# EAGLE design bc-cpu (EAGLE 7.3.0)
CNAME: Battery Bank Display Controller; CREVISION: 1.0; DESIGNER: Andrew Maltsev
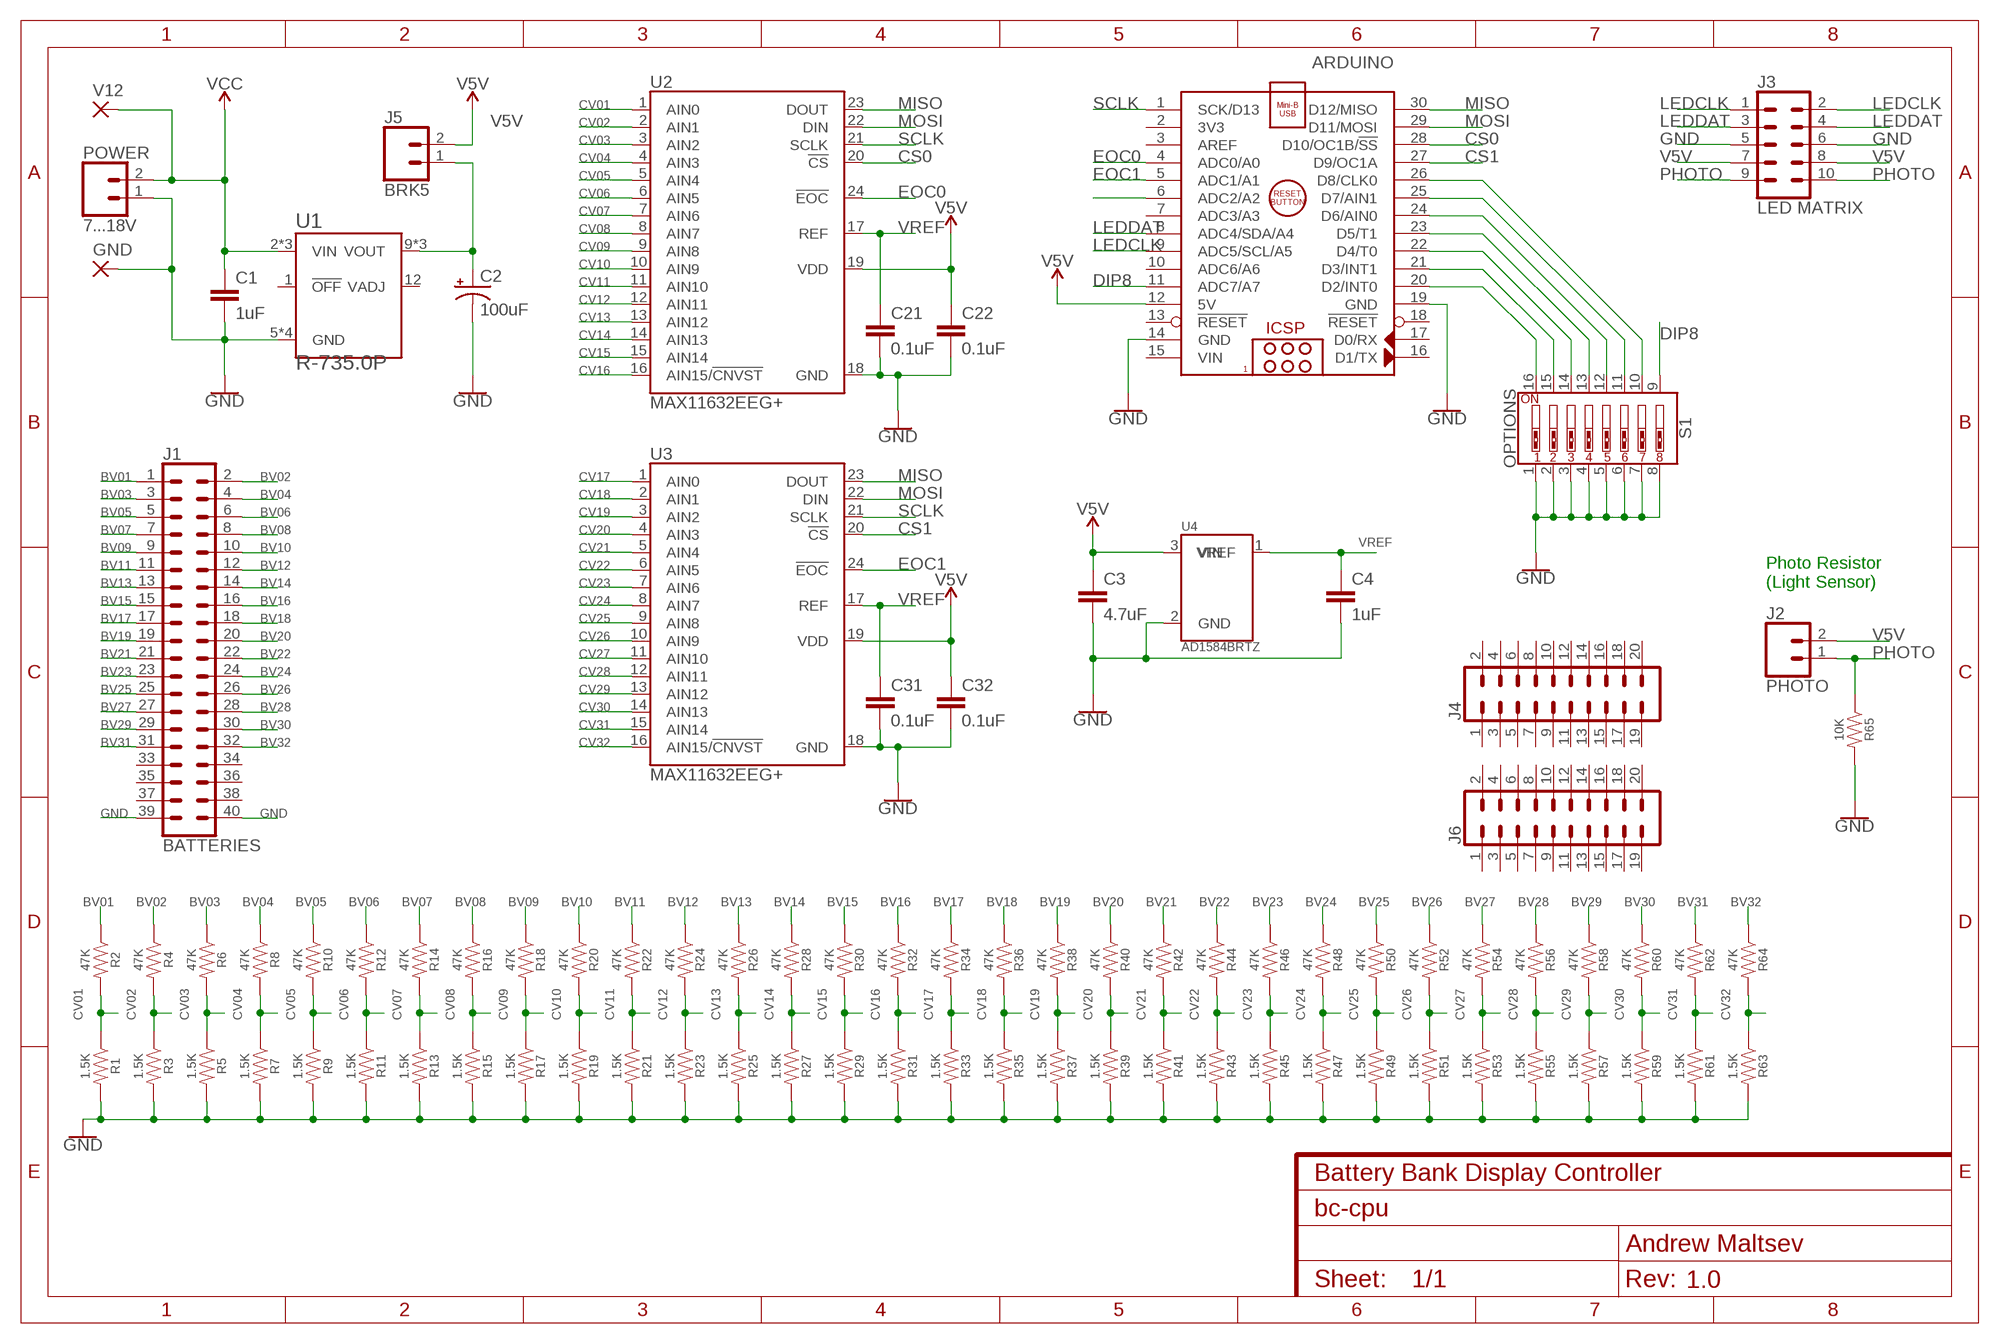
[diagram p0: schematic, sheet 1]

## Parts
ARDUINO  ARDUINO_NANO  [ARDUINO_NANO]
C1  1uF  C5/3  [C5B3]
C2  100uF  100UF-POLAR-RADIAL-2.5MM-25V-20%  [CPOL-RADIAL-2.5MM-6.5MM]
C3  4.7uF  C5/3  [C5B3]
C4  1uF  C5/3  [C5B3]
C21  0.1uF  C5/3  [C5B3]
C22  0.1uF  C5/3  [C5B3]
C31  0.1uF  C5/3  [C5B3]
C32  0.1uF  C5/3  [C5B3]
GND  WIREPAD3,17/1,2  [3,17/1,2]
J1  BATTERIES  CONN_20X2SHROUDED  [2X20_SHROUDED]
J2  PHOTO  CONN_02  [1X02]
J3  LED MATRIX  CONN_05X2SHD  [2X5-SHROUDED]
J4  CONN_10X2NOSILK  [2X10_NOSILK]
J5  BRK5  CONN_02  [1X02]
J6  CONN_10X2NOSILK  [2X10_NOSILK]
POWER  7...18V  CONN_02  [1X02]
R1  1.5K  RESISTOR1206  [1206]
R2  47K  RESISTOR1206  [1206]
R3  1.5K  RESISTOR1206  [1206]
R4  47K  RESISTOR1206  [1206]
R5  1.5K  RESISTOR1206  [1206]
R6  47K  RESISTOR1206  [1206]
R7  1.5K  RESISTOR1206  [1206]
R8  47K  RESISTOR1206  [1206]
R9  1.5K  RESISTOR1206  [1206]
R10  47K  RESISTOR1206  [1206]
R11  1.5K  RESISTOR1206  [1206]
R12  47K  RESISTOR1206  [1206]
R13  1.5K  RESISTOR1206  [1206]
R14  47K  RESISTOR1206  [1206]
R15  1.5K  RESISTOR1206  [1206]
R16  47K  RESISTOR1206  [1206]
R17  1.5K  RESISTOR1206  [1206]
R18  47K  RESISTOR1206  [1206]
R19  1.5K  RESISTOR1206  [1206]
R20  47K  RESISTOR1206  [1206]
R21  1.5K  RESISTOR1206  [1206]
R22  47K  RESISTOR1206  [1206]
R23  1.5K  RESISTOR1206  [1206]
R24  47K  RESISTOR1206  [1206]
R25  1.5K  RESISTOR1206  [1206]
R26  47K  RESISTOR1206  [1206]
R27  1.5K  RESISTOR1206  [1206]
R28  47K  RESISTOR1206  [1206]
R29  1.5K  RESISTOR1206  [1206]
R30  47K  RESISTOR1206  [1206]
R31  1.5K  RESISTOR1206  [1206]
R32  47K  RESISTOR1206  [1206]
R33  1.5K  RESISTOR1206  [1206]
R34  47K  RESISTOR1206  [1206]
R35  1.5K  RESISTOR1206  [1206]
R36  47K  RESISTOR1206  [1206]
R37  1.5K  RESISTOR1206  [1206]
R38  47K  RESISTOR1206  [1206]
R39  1.5K  RESISTOR1206  [1206]
R40  47K  RESISTOR1206  [1206]
R41  1.5K  RESISTOR1206  [1206]
R42  47K  RESISTOR1206  [1206]
R43  1.5K  RESISTOR1206  [1206]
R44  47K  RESISTOR1206  [1206]
R45  1.5K  RESISTOR1206  [1206]
R46  47K  RESISTOR1206  [1206]
R47  1.5K  RESISTOR1206  [1206]
R48  47K  RESISTOR1206  [1206]
R49  1.5K  RESISTOR1206  [1206]
R50  47K  RESISTOR1206  [1206]
R51  1.5K  RESISTOR1206  [1206]
R52  47K  RESISTOR1206  [1206]
R53  1.5K  RESISTOR1206  [1206]
R54  47K  RESISTOR1206  [1206]
R55  1.5K  RESISTOR1206  [1206]
R56  47K  RESISTOR1206  [1206]
R57  1.5K  RESISTOR1206  [1206]
R58  47K  RESISTOR1206  [1206]
R59  1.5K  RESISTOR1206  [1206]
R60  47K  RESISTOR1206  [1206]
R61  1.5K  RESISTOR1206  [1206]
R62  47K  RESISTOR1206  [1206]
R63  1.5K  RESISTOR1206  [1206]
R64  47K  RESISTOR1206  [1206]
R65  10K  RESISTORAXIAL-0.3  [AXIAL-0.3]
S1  OPTIONS  DIP-08-PTH  [DIPSWITCH-08]
U1  R-735.0P  RECOM-R-7XX.XXPTH  [RECOM-R-7XX.XX]
U2  MAX11632EEG+  MAX-11632QSOP24  [QSOP24]
U3  MAX11632EEG+  MAX-11632QSOP24  [QSOP24]
U4  AD1584BRTZ  AD1582  [SOT23-3]
V12  WIREPAD3,17/1,2  [3,17/1,2]

## Nets
BV01: J1.1 R2.1
BV02: J1.2 R4.1
BV03: J1.3 R6.1
BV04: J1.4 R8.1
BV05: J1.5 R10.1
BV06: J1.6 R12.1
BV07: J1.7 R14.1
BV08: J1.8 R16.1
BV09: J1.9 R18.1
BV10: J1.10 R20.1
BV11: J1.11 R22.1
BV12: J1.12 R24.1
BV13: J1.13 R26.1
BV14: J1.14 R28.1
BV15: J1.15 R30.1
BV16: J1.16 R32.1
BV17: J1.17 R34.1
BV18: J1.18 R36.1
BV19: J1.19 R38.1
BV20: J1.20 R40.1
BV21: J1.21 R42.1
BV22: J1.22 R44.1
BV23: J1.23 R46.1
BV24: J1.24 R48.1
BV25: J1.25 R50.1
BV26: J1.26 R52.1
BV27: J1.27 R54.1
BV28: J1.28 R56.1
BV29: J1.29 R58.1
BV30: J1.30 R60.1
BV31: J1.31 R62.1
BV32: J1.32 R64.1
CS0: ARDUINO.28(D10/OC1B/!SS) U2.20(!CS)
CS1: ARDUINO.27(D9/OC1A) U3.20(!CS)
CV01: R1.1 R2.2 U2.1(AIN0)
CV02: R3.1 R4.2 U2.2(AIN1)
CV03: R5.1 R6.2 U2.3(AIN2)
CV04: R7.1 R8.2 U2.4(AIN3)
CV05: R9.1 R10.2 U2.5(AIN4)
CV06: R11.1 R12.2 U2.6(AIN5)
CV07: R13.1 R14.2 U2.7(AIN6)
CV08: R15.1 R16.2 U2.8(AIN7)
CV09: R17.1 R18.2 U2.9(AIN8)
CV10: R19.1 R20.2 U2.10(AIN9)
CV11: R21.1 R22.2 U2.11(AIN10)
CV12: R23.1 R24.2 U2.12(AIN11)
CV13: R25.1 R26.2 U2.13(AIN12)
CV14: R27.1 R28.2 U2.14(AIN13)
CV15: R29.1 R30.2 U2.15(AIN14)
CV16: R31.1 R32.2 U2.16(AIN15/!CNVST)
CV17: R33.1 R34.2 U3.1(AIN0)
CV18: R35.1 R36.2 U3.2(AIN1)
CV19: R37.1 R38.2 U3.3(AIN2)
CV20: R39.1 R40.2 U3.4(AIN3)
CV21: R41.1 R42.2 U3.5(AIN4)
CV22: R43.1 R44.2 U3.6(AIN5)
CV23: R45.1 R46.2 U3.7(AIN6)
CV24: R47.1 R48.2 U3.8(AIN7)
CV25: R49.1 R50.2 U3.9(AIN8)
CV26: R51.1 R52.2 U3.10(AIN9)
CV27: R53.1 R54.2 U3.11(AIN10)
CV28: R55.1 R56.2 U3.12(AIN11)
CV29: R57.1 R58.2 U3.13(AIN12)
CV30: R59.1 R60.2 U3.14(AIN13)
CV31: R61.1 R62.2 U3.15(AIN14)
CV32: R63.1 R64.2 U3.16(AIN15/!CNVST)
DIP1: ARDUINO.20(D2/INT0) S1.16
DIP2: ARDUINO.21(D3/INT1) S1.15
DIP3: ARDUINO.22(D4/T0) S1.14
DIP4: ARDUINO.23(D5/T1) S1.13
DIP5: ARDUINO.24(D6/AIN0) S1.12
DIP6: ARDUINO.25(D7/AIN1) S1.11
DIP7: ARDUINO.26(D8/CLK0) S1.10
DIP8: ARDUINO.11(ADC7/A7) S1.9
EOC0: ARDUINO.4(ADC0/A0) U2.24(!EOC)
EOC1: ARDUINO.5(ADC1/A1) U3.24(!EOC)
GND: ARDUINO.14(GND) ARDUINO.19(GND) C1.2 C2.2(-) C3.2 C4.2 C21.2 C22.2 C31.2 C32.2 GND.1(P) J1.39 J1.40 J3.5 J3.6 POWER.1 R1.2 R3.2 R5.2 R7.2 R9.2 R11.2 R13.2 R15.2 R17.2 R19.2 R21.2 R23.2 R25.2 R27.2 R29.2 R31.2 R33.2 R35.2 R37.2 R39.2 R41.2 R43.2 R45.2 R47.2 R49.2 R51.2 R53.2 R55.2 R57.2 R59.2 R61.2 R63.2 R65.P$2 S1.1 S1.2 S1.3 S1.4 S1.5 S1.6 S1.7 S1.8 U1.5(GND) U1.6(GND) U1.7(GND) U1.8(GND) U2.18(GND) U3.18(GND) U4.2(GND)
LEDCLK: ARDUINO.9(ADC5/SCL/A5) J3.1 J3.2
LEDDAT: ARDUINO.8(ADC4/SDA/A4) J3.3 J3.4
MISO: ARDUINO.30(D12/MISO) U2.23(DOUT) U3.23(DOUT)
MOSI: ARDUINO.29(D11/MOSI) U2.22(DIN) U3.22(DIN)
N$11: C2.1(+) J5.1 U1.9(VOUT) U1.10(VOUT) U1.11(VOUT)
PHOTO: ARDUINO.6(ADC2/A2) J2.1 J3.9 J3.10 R65.P$1
SCLK: ARDUINO.1(SCK/D13) U2.21(SCLK) U3.21(SCLK)
V5V: ARDUINO.12(5V) C3.1 C22.1 C32.1 J2.2 J3.7 J3.8 J5.2 U2.19(VDD) U3.19(VDD) U4.3(VIN)
VCC: C1.1 POWER.2 U1.2(VIN) U1.3(VIN) U1.4(VIN) V12.1(P)
VREF: C4.1 C21.1 C31.1 U2.17(REF) U3.17(REF) U4.1(VREF)
Unconnected: ARDUINO.2(3V3) ARDUINO.3(AREF) ARDUINO.7(ADC3/A3) ARDUINO.10(ADC6/A6) ARDUINO.13(!RESET) ARDUINO.16(D1/TX) ARDUINO.17(D0/RX) ARDUINO.18(!RESET) J1.33 J1.34 J1.35 J1.36 J1.37 J1.38 J4.1 J4.2 J4.3 J4.4 J4.5 J4.6 J4.7 J4.8 J4.9 J4.10 J4.11 J4.12 J4.13 J4.14 J4.15 J4.16 J4.17 J4.18 J4.19 J4.20 J6.1 J6.2 J6.3 J6.4 J6.5 J6.6 J6.7 J6.8 J6.9 J6.10 J6.11 J6.12 J6.13 J6.14 J6.15 J6.16 J6.17 J6.18 J6.19 J6.20 U1.1(!OFF) U1.12(VADJ)

## Notes on the sheet
- Photo Resistor
  (Light Sensor)

## Power pins joined to a net without a drawn wire
VIN: ARDUINO.15(VIN)

## Library data of the parts
ARDUINO = ArduinoNanoV30:ARDUINO_NANO: Arduino Nano V3.0 Module Overview: The Arduino Nano is a small, complete, and breadboard-friendly board based on the ATmega328 (Arduino Nano 3.x) or ATmega168 (Arduino Nano 2.x). It has more or less the same functionality of the Arduino Duemilanove, but in a different package. It lacks only a DC power jack, and works with a Mini-B USB cable instead of a standard one. The Nano was designed and is being produced by Gravitech <http://www.gravitech.us/arna30wiatp.html>. General specifications: Item Value Microcontroller Atmel ATmega168 or ATmega328 Operating Voltage (logic level) 5 V Input Voltage (recommended) 7-12 V Input Voltage (limits) 6-20 V Digital I/O Pins 14 (of which 6 provide PWM output) Analog Input Pins 8 DC Current per I/O Pin 40 mA Flash Memory 16 KB (ATmega168) or 32 KB (ATmega328) of which 2 KB used by bootloader SRAM 1 KB (ATmega168) or 2 KB (ATmega328) EEPROM 512 bytes (ATmega168) or 1 KB (ATmega328) Clock Speed 16 MHz Dimensions (Inches) 0.73" x 1.70" Dimensions (mm) 18mm x 45mm Overall height About 9 mm (not including pins) Weigth 5 g Power: The Arduino Nano can be powered via the Mini-B USB connection, 6-20V unregulated external power supply (pin 30), or 5V regulated external power supply (pin 27). The power source is automatically selected to the highest voltage source. Memory: The ATmega168 has 16 KB of flash memory for storing code (of which 2 KB is used for the bootloader); the ATmega328 has 32 KB, (also with 2 KB used for the bootloader). The ATmega168 has 1 KB of SRAM and 512 bytes of EEPROM (which can be read and written with the EEPROM library); the ATmega328 has 2 KB of SRAM and 1 KB of EEPROM. Input and Output: Each of the 14 digital pins on the Nano can be used as an input or output, using pinMode(), digitalWrite(), and digitalRead() functions. They operate at 5 volts. Each pin can provide or receive a maximum of 40 mA and has an internal pull-up resistor (disconnected by default) of 20-50 kOhms. In addition, some pins have specialized functions. Visit Arduino - ArduinoBoardNano <https://www.arduino.cc/en/Main/ArduinoBoardNano>
C1 C3 C4 C21 C22 C31 C32 = capacitor-wima:C: CAPACITOR naming: grid - package width
C2 = SparkFun-Capacitors:100UF-POLAR: 100µF polarized capacitors A capacitor is a passive two-terminal electrical component used to store electrical energy temporarily in an electric field.; PROD_ID: CAP-08439
GND V12 = wirepad:WIREPAD: Wire PAD connect wire on PCB
J1 = SparkFun-Connectors:CONN_20X2: Multi connection point. Often used as Generic Header-pin footprint for 0.1 inch spaced/style header connections On any of the 0.1 inch spaced packages, you can populate with these: Break Away Headers - Straight <https://www.sparkfun.com/products/116> (PRT-00116) Break Away Male Headers - Right Angle <https://www.sparkfun.com/products/553> (PRT-00553) Female Headers <https://www.sparkfun.com/products/115> (PRT-00115) Break Away Headers - Machine Pin <https://www.sparkfun.com/products/117> (PRT-00117) Break Away Female Headers - Swiss Machine Pin <https://www.sparkfun.com/products/743> (PRT-00743); PROD_ID: CONN-12263; SF_ID: CONN-12263
J2 J5 POWER = SparkFun-Connectors:CONN_02: Multi connection point. Often used as Generic Header-pin footprint for 0.1 inch spaced/style header connections On any of the 0.1 inch spaced packages, you can populate with these: Break Away Headers - Straight <https://www.sparkfun.com/products/116> (PRT-00116) Break Away Male Headers - Right Angle <https://www.sparkfun.com/products/553> (PRT-00553) Female Headers <https://www.sparkfun.com/products/115> (PRT-00115) Break Away Headers - Machine Pin <https://www.sparkfun.com/products/117> (PRT-00117) Break Away Female Headers - Swiss Machine Pin <https://www.sparkfun.com/products/743> (PRT-00743) For SCREWTERMINALS and SPRING TERMINALS visit here: Screw Terimnals on SparkFun.com <https://www.sparkfun.com/search/results?term=Screw+Terminals> (5mm/3.5mm/2.54mm spacing) This device is also useful as a general connection point to wire up your design to another part of your project. Our various solder wires solder well into these plated through hole pads. Hook-Up Wire - Assortment (Stranded, 22 AWG) <https://www.sparkfun.com/products/11375> (PRT-11375) Hook-Up Wire - Assortment (Solid Core, 22 AWG) <https://www.sparkfun.com/products/11367> (PRT-11367) View the entire wire category on our website here <https://www.sparkfun.com/categories/141> Special notes: Molex polarized connector foot print use with: PRT-08233 with associated crimp pins and housings. 2.54_SCREWTERM for use with PRT-10571. 3.5mm Screw Terminal footprints for PRT-08084 5mm Screw Terminal footprints for use with PRT-08432
J3 = SparkFun-Connectors:CONN_05X2: Multi connection point. Often used as Generic Header-pin footprint for 0.1 inch spaced/style header connections For AVR SPI programming port, see special device with nice symbol: "AVR_SPI_PROG_5x2.dev" You can populate with any combo of single row headers, but if you'd like an exact match, check these: 2x5 AVR ICSP Male Header <https://www.sparkfun.com/products/778> (PRT-00778) 2x5 Pin Shrouded Header <https://www.sparkfun.com/products/8506> (PRT-08506) On any of the 0.1 inch spaced packages, you can populate with these: Break Away Headers - Straight <https://www.sparkfun.com/products/116> (PRT-00116) Break Away Male Headers - Right Angle <https://www.sparkfun.com/products/553> (PRT-00553) Female Headers <https://www.sparkfun.com/products/115> (PRT-00115) Break Away Headers - Machine Pin <https://www.sparkfun.com/products/117> (PRT-00117) Break Away Female Headers - Swiss Machine Pin <https://www.sparkfun.com/products/743> (PRT-00743) Special note: the shrouded connector mates well with our 5x2 ribbon cables: 2x5 Pin IDC Ribbon Cable <https://www.sparkfun.com/products/8535> (PRT-08535); PROD_ID: CONN-08671; SF_ID: PRT-08506
J4 J6 = SparkFun-Connectors:CONN_10X2: Multi connection point. Often used as Generic Header-pin footprint for 0.1 inch spaced/style header connections On any of the 0.1 inch spaced packages, you can populate with these: Break Away Headers - Straight <https://www.sparkfun.com/products/116> (PRT-00116) Break Away Male Headers - Right Angle <https://www.sparkfun.com/products/553> (PRT-00553) Female Headers <https://www.sparkfun.com/products/115> (PRT-00115) Break Away Headers - Machine Pin <https://www.sparkfun.com/products/117> (PRT-00117) Break Away Female Headers - Swiss Machine Pin <https://www.sparkfun.com/products/743> (PRT-00743) Special note about the "SPECIAL" package: This was SPECIALLY designed to be used with our Graphic LCD Backpack. Be sure you want to use this! It is not only staggered on each line of header holes, but IT IS ALSO offset of the center point of the top and bottom lines by 5 mil. This causes the headers to lock into place on the "standard" footprint on the LCD screen. The extra squares on the tdocu layer are there simply to reference other pins (if you were to actually populate a longer header than ten long - this is what we do with the backpacks).
R1-R65 = SparkFun-Resistors:RESISTOR: Generic Resistor Package
S1 = SparkFun-Switches:DIP-08: 8-Position DIP Switch 8-circuit DIP (dual inline package) switch. Commonly used to physcially set a circuit's behavior. SparkFun Products DIP Switch - 8 Position <https://www.sparkfun.com/products/8034> (COM-08034); PROD_ID: SWCH-12197; SF_SKU: COM-08034
U1 = Recom-R-735:RECOM-R-7XX.XX: RECOM R-7xx.xx DC-DC high efficiency board mounted voltage converter.
U2 U3 = MAX-11632:MAX-11632: MAX-11632 16-channel 12-Bit, 300ksps ADC with FIFO and Internal Reference https://www.digikey.com/product-detail/en/maxim-integrated/MAX11632EEG-/MAX11632EEG--ND/2591495
U4 = VREF-AD1582-85:AD1582

## Board
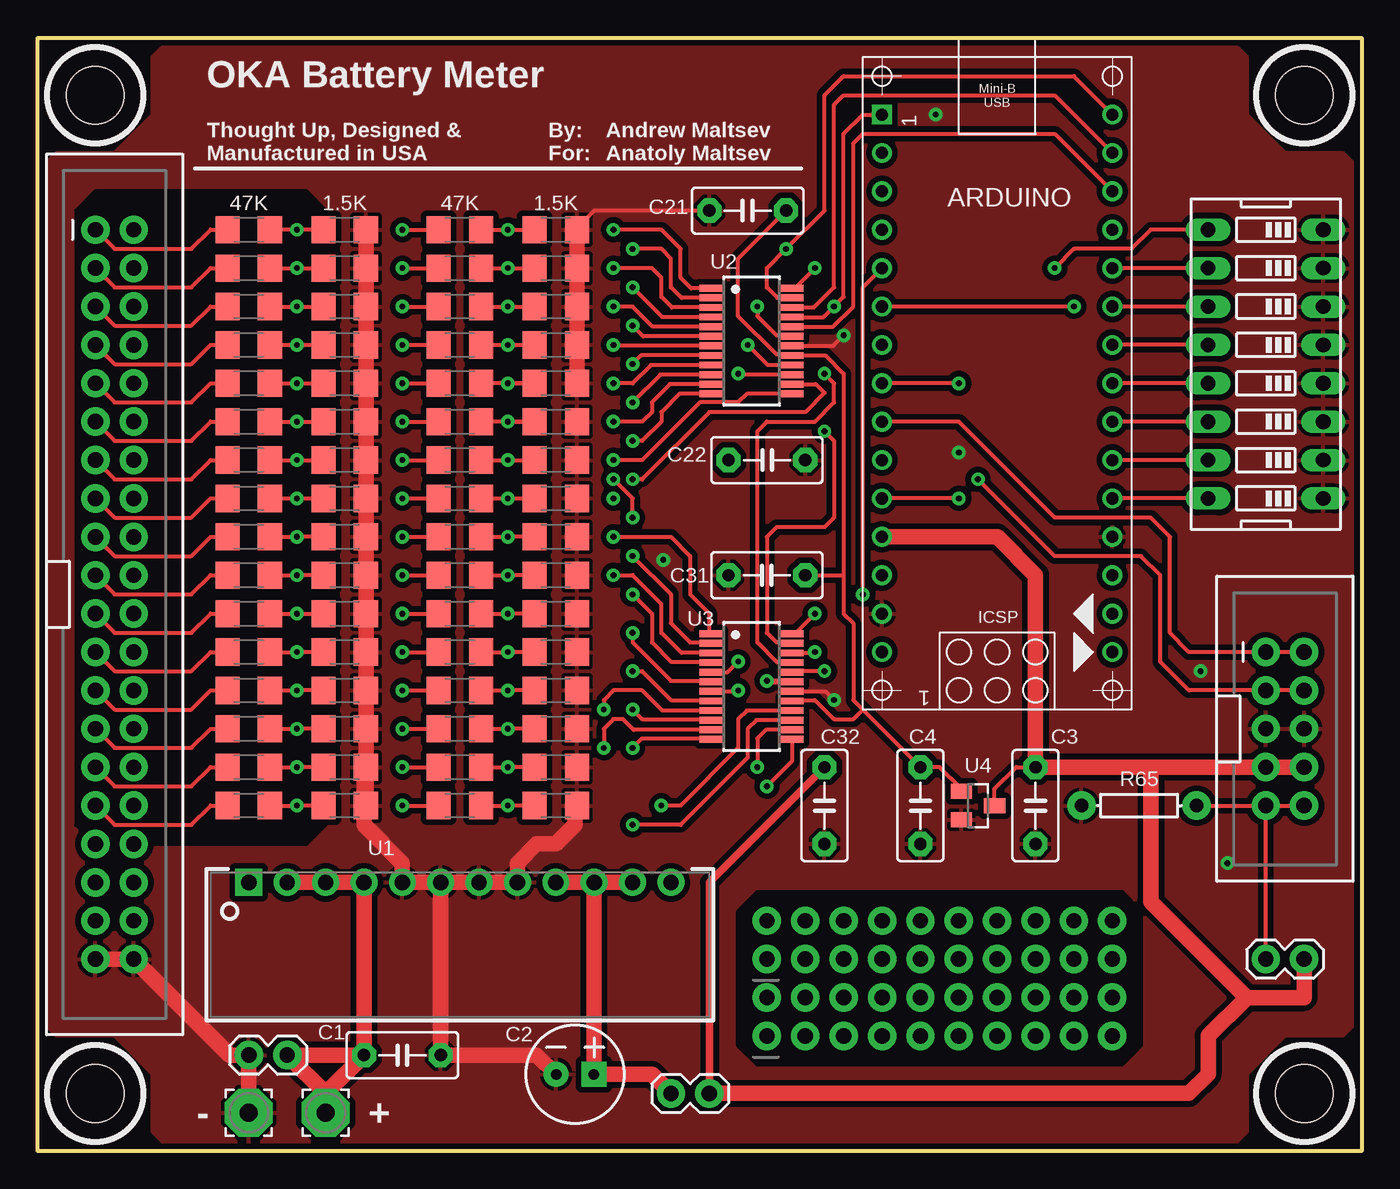
[diagram p1: board, top side]
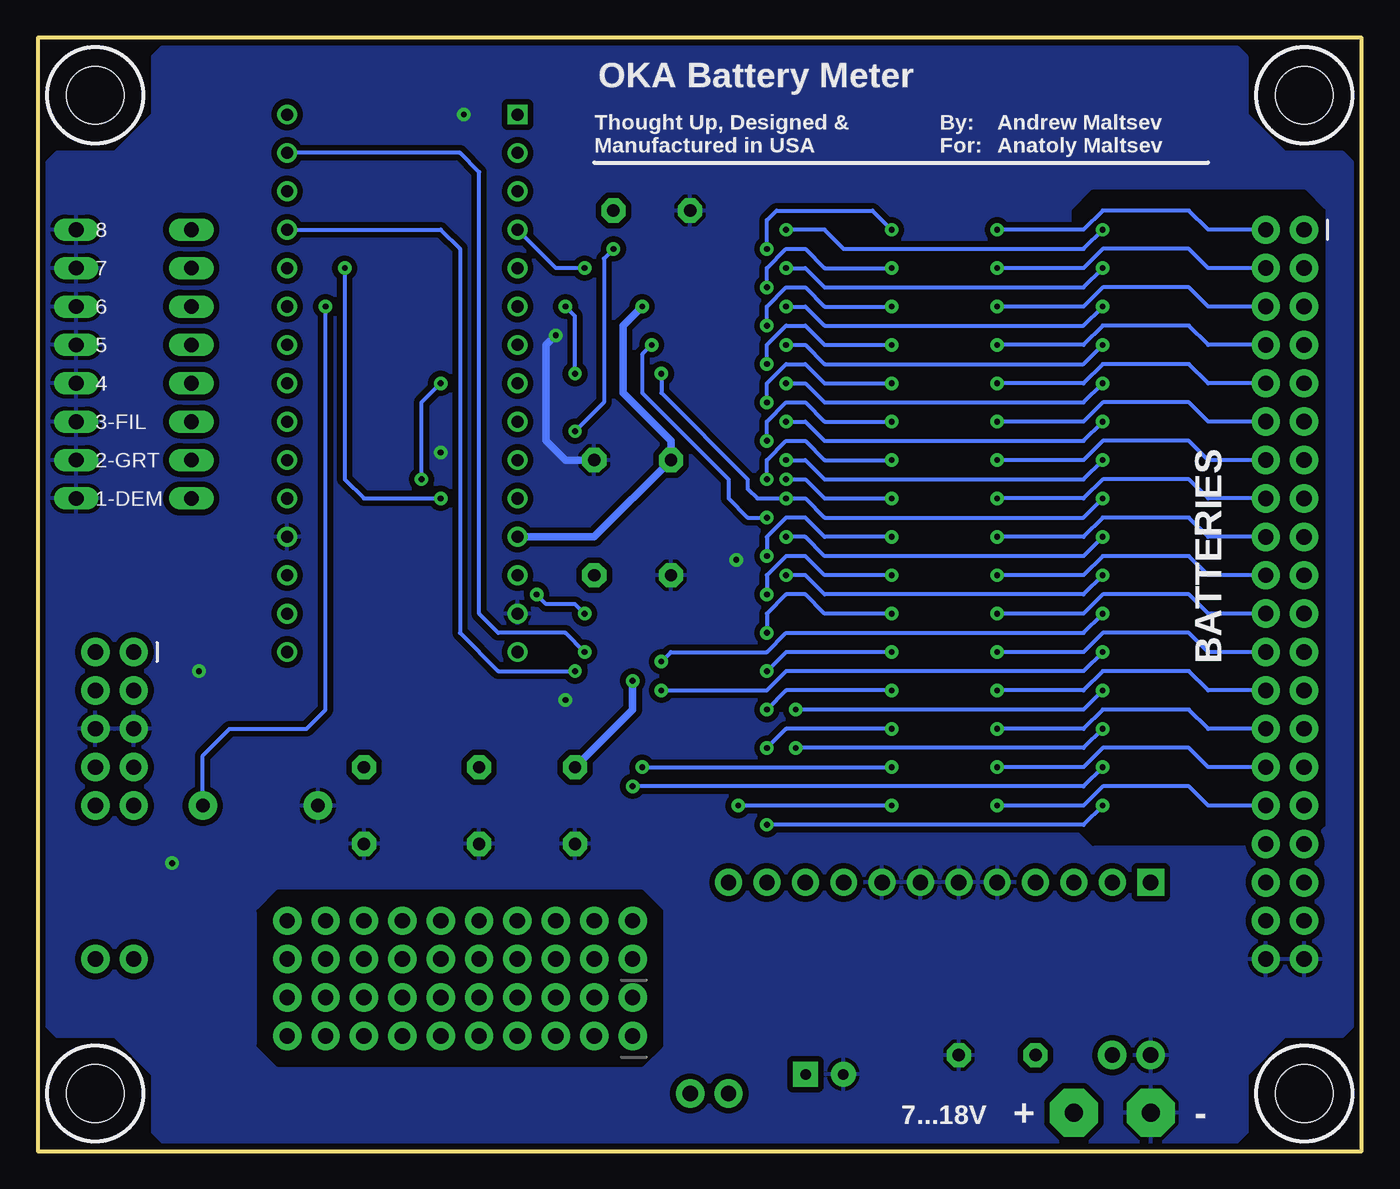
[diagram p2: board, bottom side, seen from below]

Size 87.63 x 73.66 mm. Coordinates in mm from the lower left corner, seen from the top.
Outline: 0,0 0,73.66 87.63,73.66 87.63,0 0,0
Copper layers (1*16): Top 0.035mm / dielectric 1.5mm / Bottom 0.035mm
Design rules "SparkFun-2-layer-STANDARD *": minimum track width 10mil, minimum drill 10mil, track to track 10mil, track to pad 8mil, pad to pad 8mil, via to via 10mil, smd to smd 8mil, copper to edge 12mil, drill to drill 12mil, minimum pad ring 10mil, minimum via ring 10mil, stop-mask expansion 4mil, vias tented up to drill 25mil, thermal gap 10mil
Holes 3.81 mm at 3.81,3.81 3.81,69.85 83.82,69.85 83.82,3.81

### Footprints (pad centres in the part's own frame; a part is rotated, then mirrored left to right if it is on the bottom)
ARDUINO_NANO = drill 0.8 square: 1 -20.32,-7.62 | drill 0.8: 2 -17.78,-7.62; 3 -15.24,-7.62; 4 -12.7,-7.62; 5 -10.16,-7.62; 6 -7.62,-7.62; 7 -5.08,-7.62; 8 -2.54,-7.62; 9 0,-7.62; 10 2.54,-7.62; 11 5.08,-7.62; 12 7.62,-7.62; 13 10.16,-7.62; 14 12.7,-7.62; 15 15.24,-7.62; 16 15.24,7.62; 17 12.7,7.62; 18 10.16,7.62; 19 7.62,7.62; 20 5.08,7.62; 21 2.54,7.62; 22 0,7.62; 23 -2.54,7.62; 24 -5.08,7.62; 25 -7.62,7.62; 26 -10.16,7.62; 27 -12.7,7.62; 28 -15.24,7.62; 29 -17.78,7.62; 30 -20.32,7.62
C5B3 = drill 0.813 pad 1.6 octagon: 1 -2.54,0; 2 2.54,0
CPOL-RADIAL-2.5MM-6.5MM = drill 0.7 pad 1.651 square: 1 1.25,0 | drill 0.7 pad 1.651: 2 -1.25,0
3,17/1,2 = drill 1.194 pad 3.175 octagon: 1 0,0
2X20_SHROUDED = drill 1.016 pad 1.88: 1 -1.27,24.13; 2 1.27,24.13; 3 -1.27,21.59; 4 1.27,21.59; 5 -1.27,19.05; 6 1.27,19.05; 7 -1.27,16.51; 8 1.27,16.51; 9 -1.27,13.97; 10 1.27,13.97; 11 -1.27,11.43; 12 1.27,11.43; 13 -1.27,8.89; 14 1.27,8.89; 15 -1.27,6.35; 16 1.27,6.35; 17 -1.27,3.81; 18 1.27,3.81; 19 -1.27,1.27; 20 1.27,1.27; 21 -1.27,-1.27; 22 1.27,-1.27; 23 -1.27,-3.81; 24 1.27,-3.81; 25 -1.27,-6.35; 26 1.27,-6.35; 27 -1.27,-8.89; 28 1.27,-8.89; 29 -1.27,-11.43; 30 1.27,-11.43; 31 -1.27,-13.97; 32 1.27,-13.97; 33 -1.27,-16.51; 34 1.27,-16.51; 35 -1.27,-19.05; 36 1.27,-19.05; 37 -1.27,-21.59; 38 1.27,-21.59; 39 -1.27,-24.13; 40 1.27,-24.13
1X02 = drill 1.016 pad 1.88: 1 0,0; 2 2.54,0
2X5-SHROUDED = drill 1.016 pad 1.88: 1 -1.27,5.08; 2 1.27,5.08; 3 -1.27,2.54; 4 1.27,2.54; 5 -1.27,0; 6 1.27,0; 7 -1.27,-2.54; 8 1.27,-2.54; 9 -1.27,-5.08; 10 1.27,-5.08
2X10_NOSILK = drill 1.016 pad 1.88: 1 0,0; 2 0,2.54; 3 2.54,0; 4 2.54,2.54; 5 5.08,0; 6 5.08,2.54; 7 7.62,0; 8 7.62,2.54; 9 10.16,0; 10 10.16,2.54; 11 12.7,0; 12 12.7,2.54; 13 15.24,0; 14 15.24,2.54; 15 17.78,0; 16 17.78,2.54; 17 20.32,0; 18 20.32,2.54; 19 22.86,0; 20 22.86,2.54
1206 = smd 1.6 x 1.8: 1 -1.4,0; 2 1.4,0
AXIAL-0.3 = drill 0.9 pad 1.88: P$1 -3.81,0; P$2 3.81,0
DIPSWITCH-08 = drill 0.97 long: 1 -8.89,-3.81; 2 -6.35,-3.81; 3 -3.81,-3.81; 4 -1.27,-3.81; 5 1.27,-3.81; 6 3.81,-3.81; 7 6.35,-3.81; 8 8.89,-3.81; 9 8.89,3.81; 10 6.35,3.81; 11 3.81,3.81; 12 1.27,3.81; 13 -1.27,3.81; 14 -3.81,3.81; 15 -6.35,3.81; 16 -8.89,3.81
RECOM-R-7XX.XX = drill 1.016 pad 1.778 square: 1 0,0 | drill 1.016 pad 1.778: 2 2.54,0; 3 5.08,0; 4 7.62,0; 5 10.16,0; 6 12.7,0; 7 15.24,0; 8 17.78,0; 9 20.32,0; 10 22.86,0; 11 25.4,0; 12 27.94,0
QSOP24 = smd 0.45 x 1.5: 1 -3.493,-2.69; 2 -2.857,-2.69; 3 -2.223,-2.69; 4 -1.587,-2.69; 5 -0.953,-2.69; 6 -0.318,-2.69; 7 0.318,-2.69; 8 0.953,-2.69; 9 1.587,-2.69; 10 2.223,-2.69; 11 2.857,-2.69; 12 3.493,-2.69; 13 3.493,2.69; 14 2.857,2.69; 15 2.223,2.69; 16 1.587,2.69; 17 0.953,2.69; 18 0.318,2.69; 19 -0.318,2.69; 20 -0.953,2.69; 21 -1.587,2.69; 22 -2.223,2.69; 23 -2.857,2.69; 24 -3.493,2.69
SOT23-3 = smd 1 x 1.4: 1 -0.95,-1.1; 2 0.95,-1.1; 3 0,1.1

### Placement (x,y rotation side)
ARDUINO  63.5,48.26 270 top
C1  24.13,6.35 0 top
C2  35.56,5.08 0 top
C3  66.04,22.86 270 top
C4  58.42,22.86 270 top
C21  46.99,62.23 180 top
C22  48.26,45.72 0 top
C31  48.26,38.1 180 top
C32  52.07,22.86 270 top
GND  13.97,2.54 0 top
J1  5.08,36.83 0 top
J2  81.28,12.7 0 top
J3  82.55,27.94 0 top
J4  48.26,7.62 0 top
J5  41.91,3.81 0 top
J6  48.26,12.7 0 top
POWER  13.97,6.35 0 top
R1  20.32,60.96 0 top
R2  13.97,60.96 0 top
R3  34.29,60.96 0 top
R4  27.94,60.96 0 top
R5  20.32,58.42 0 top
R6  13.97,58.42 0 top
R7  34.29,58.42 0 top
R8  27.94,58.42 0 top
R9  20.32,55.88 0 top
R10  13.97,55.88 0 top
R11  34.29,55.88 0 top
R12  27.94,55.88 0 top
R13  20.32,53.34 0 top
R14  13.97,53.34 0 top
R15  34.29,53.34 0 top
R16  27.94,53.34 0 top
R17  20.32,50.8 0 top
R18  13.97,50.8 0 top
R19  34.29,50.8 0 top
R20  27.94,50.8 0 top
R21  20.32,48.26 0 top
R22  13.97,48.26 0 top
R23  34.29,48.26 0 top
R24  27.94,48.26 0 top
R25  20.32,45.72 0 top
R26  13.97,45.72 0 top
R27  34.29,45.72 0 top
R28  27.94,45.72 0 top
R29  20.32,43.18 0 top
R30  13.97,43.18 0 top
R31  34.29,43.18 0 top
R32  27.94,43.18 0 top
R33  20.32,40.64 0 top
R34  13.97,40.64 0 top
R35  34.29,40.64 0 top
R36  27.94,40.64 0 top
R37  20.32,38.1 0 top
R38  13.97,38.1 0 top
R39  34.29,38.1 0 top
R40  27.94,38.1 0 top
R41  20.32,35.56 0 top
R42  13.97,35.56 0 top
R43  34.29,35.56 0 top
R44  27.94,35.56 0 top
R45  20.32,33.02 0 top
R46  13.97,33.02 0 top
R47  34.29,33.02 0 top
R48  27.94,33.02 0 top
R49  20.32,30.48 0 top
R50  13.97,30.48 0 top
R51  34.29,30.48 0 top
R52  27.94,30.48 0 top
R53  20.32,27.94 0 top
R54  13.97,27.94 0 top
R55  34.29,27.94 0 top
R56  27.94,27.94 0 top
R57  20.32,25.4 0 top
R58  13.97,25.4 0 top
R59  34.29,25.4 0 top
R60  27.94,25.4 0 top
R61  20.32,22.86 0 top
R62  13.97,22.86 0 top
R63  34.29,22.86 0 top
R64  27.94,22.86 0 top
R65  72.9,22.86 180 top
S1  81.28,52.07 90 top
U1  13.97,17.78 0 top
U2  47.24,53.59 270 top
U3  47.24,30.73 270 top
U4  62.23,22.86 270 top
V12  19.05,2.54 0 top

### Tracks (layer width: path | path; a pad name or v marks a point on that pad's centre or on a via)
BV01
  Top 0.254: J1.1 5.08,59.69 10.16,59.69 11.43,60.96 R2.1
BV02  (via drill 0.38)
  Top 0.254: v24.13,60.96 R4.1
  Bottom 0.254: J1.2 10.16,60.96 11.43,62.23 17.14,62.23 18.41,60.96 v24.13,60.96
BV03
  Top 0.254: J1.3 5.08,57.15 10.16,57.15 11.43,58.42 R6.1
BV04  (via drill 0.38)
  Top 0.254: v24.13,58.42 R8.1
  Bottom 0.254: J1.4 10.16,58.42 11.43,59.69 17.14,59.69 18.41,58.42 v24.13,58.42
BV05
  Top 0.254: J1.5 5.08,54.61 10.16,54.61 11.43,55.88 R10.1
BV06  (via drill 0.38)
  Top 0.254: v24.13,55.88 R12.1
  Bottom 0.254: J1.6 10.16,55.88 11.43,57.15 17.14,57.15 18.41,55.88 v24.13,55.88
BV07
  Top 0.254: J1.7 5.08,52.07 10.16,52.07 11.43,53.34 R14.1
BV08  (via drill 0.38)
  Top 0.254: v24.13,53.34 R16.1
  Bottom 0.254: J1.8 10.16,53.34 11.43,54.61 17.14,54.61 18.41,53.34 v24.13,53.34
BV09
  Top 0.254: J1.9 5.08,49.53 10.16,49.53 11.43,50.8 R18.1
BV10  (via drill 0.38)
  Top 0.254: v24.13,50.8 R20.1
  Bottom 0.254: J1.10 10.16,50.8 11.43,52.07 17.14,52.07 18.41,50.8 v24.13,50.8
BV11
  Top 0.254: J1.11 5.08,46.99 10.16,46.99 11.43,48.26 R22.1
BV12  (via drill 0.38)
  Top 0.254: v24.13,48.26 R24.1
  Bottom 0.254: J1.12 10.16,48.26 11.43,49.53 17.14,49.53 18.41,48.26 v24.13,48.26
BV13
  Top 0.254: J1.13 5.08,44.45 10.16,44.45 11.43,45.72 R26.1
BV14  (via drill 0.38)
  Top 0.254: v24.13,45.72 R28.1
  Bottom 0.254: J1.14 10.16,45.72 11.43,46.99 17.14,46.99 18.41,45.72 v24.13,45.72
BV15
  Top 0.254: J1.15 5.08,41.91 10.16,41.91 11.43,43.18 R30.1
BV16  (via drill 0.38)
  Top 0.254: v24.13,43.18 R32.1
  Bottom 0.254: J1.16 10.16,43.18 11.43,44.45 17.14,44.45 18.41,43.18 v24.13,43.18
BV17
  Top 0.254: J1.17 5.08,39.37 10.16,39.37 11.43,40.64 R34.1
BV18  (via drill 0.38)
  Top 0.254: v24.13,40.64 R36.1
  Bottom 0.254: J1.18 10.16,40.64 11.43,41.91 17.14,41.91 18.41,40.64 v24.13,40.64
BV19
  Top 0.254: J1.19 5.08,36.83 10.16,36.83 11.43,38.1 R38.1
BV20  (via drill 0.38)
  Top 0.254: v24.13,38.1 R40.1
  Bottom 0.254: J1.20 10.16,38.1 11.43,39.37 17.14,39.37 18.41,38.1 v24.13,38.1
BV21
  Top 0.254: J1.21 5.08,34.29 10.16,34.29 11.43,35.56 R42.1
BV22  (via drill 0.38)
  Top 0.254: v24.13,35.56 R44.1
  Bottom 0.254: J1.22 10.16,35.56 11.43,36.83 17.14,36.83 18.41,35.56 v24.13,35.56
BV23
  Top 0.254: J1.23 5.08,31.75 10.16,31.75 11.43,33.02 R46.1
BV24  (via drill 0.38)
  Top 0.254: v24.13,33.02 R48.1
  Bottom 0.254: J1.24 10.16,33.02 11.43,34.29 17.14,34.29 18.41,33.02 v24.13,33.02
BV25
  Top 0.254: J1.25 5.08,29.21 10.16,29.21 11.43,30.48 R50.1
BV26  (via drill 0.38)
  Top 0.254: v24.13,30.48 R52.1
  Bottom 0.254: J1.26 10.16,30.48 11.43,31.75 17.14,31.75 18.41,30.48 v24.13,30.48
BV27
  Top 0.254: J1.27 5.08,26.67 10.16,26.67 11.43,27.94 R54.1
BV28  (via drill 0.38)
  Top 0.254: v24.13,27.94 R56.1
  Bottom 0.254: J1.28 10.16,27.94 11.43,29.21 17.14,29.21 18.41,27.94 v24.13,27.94
BV29
  Top 0.254: J1.29 5.08,24.13 10.16,24.13 11.43,25.4 R58.1
BV30  (via drill 0.38)
  Top 0.254: v24.13,25.4 R60.1
  Bottom 0.254: J1.30 10.16,25.4 11.43,26.67 17.14,26.67 18.41,25.4 v24.13,25.4
BV31
  Top 0.254: J1.31 5.08,21.59 10.16,21.59 11.43,22.86 R62.1
BV32  (via drill 0.38)
  Top 0.254: v24.13,22.86 R64.1
  Bottom 0.254: J1.32 10.16,22.86 11.43,24.13 17.14,24.13 18.41,22.86 v24.13,22.86
CS0
  Top 0.254: ARDUINO.28 67.31,67.31 54.61,67.31 53.98,66.67 53.98,55.88 52.64,54.55 U2.20
CS1  (via drill 0.38)
  Top 0.254: v52.07,31.75 50,31.75 U3.20
  Bottom 0.254: ARDUINO.27 60.96,60.96 59.69,59.69 59.69,34.29 57.15,31.75 v52.07,31.75
CV01  (via drill 0.38)
  Top 0.254: R2.2 v17.14,60.96 R1.1 | U2.1 43.24,57.09 42.55,57.78 42.55,59.69 41.27,60.96 v38.1,60.96
  Bottom 0.254: v38.1,60.96 35.56,60.96 34.29,59.69 18.41,59.69 v17.14,60.96
CV02  (via drill 0.38)
  Top 0.254: R4.2 v31.11,60.96 R3.1 | U2.2 42.61,56.45 41.91,57.15 41.91,59.05 41.27,59.69 v39.37,59.69
  Bottom 0.254: v39.37,59.69 39.37,61.59 38.73,62.23 32.38,62.23 v31.11,60.96
CV03  (via drill 0.38)
  Top 0.254: R6.2 v17.14,58.42 R5.1 19.05,58.42 | U2.3 41.97,55.82 41.27,56.52 41.27,57.78 40.64,58.42 v38.1,58.42
  Bottom 0.254: v38.1,58.42 36.83,58.42 35.56,57.15 18.41,57.15 v17.14,58.42
CV04  (via drill 0.38)
  Top 0.254: R8.2 v31.11,58.42 R7.1 | U2.4 41.34,55.18 v39.37,57.15
  Bottom 0.254: v39.37,57.15 39.37,58.42 38.1,59.69 36.83,59.69 35.56,58.42 v31.11,58.42
CV05  (via drill 0.38)
  Top 0.254: R10.2 v17.14,55.88 R9.1 19.05,55.88 | U2.5 40.7,54.55 39.37,55.88 v38.1,55.88
  Bottom 0.254: v38.1,55.88 36.83,55.88 35.56,54.61 18.41,54.61 v17.14,55.88
CV06  (via drill 0.38)
  Top 0.254: R12.2 v31.11,55.88 R11.1 33.02,55.88 | U2.6 40.07,53.91 v39.37,54.61
  Bottom 0.254: v39.37,54.61 39.37,55.88 38.1,57.15 36.83,57.15 35.56,55.88 v31.11,55.88
CV07  (via drill 0.38)
  Top 0.254: R14.2 v17.14,53.34 18.41,53.34 R13.1 | U2.7 38.16,53.28 v38.1,53.34
  Bottom 0.254: v38.1,53.34 36.83,53.34 35.56,52.07 18.41,52.07 v17.14,53.34
CV08  (via drill 0.38)
  Top 0.254: R16.2 v31.11,53.34 R15.1 | U2.8 39.94,52.64 v39.37,52.07
  Bottom 0.254: v39.37,52.07 39.37,53.34 38.1,54.61 36.83,54.61 35.56,53.34 v31.11,53.34
CV09  (via drill 0.38)
  Top 0.254: R18.2 v17.14,50.8 R17.1 | U2.9 40.58,52.01 39.37,50.8 v38.1,50.8
  Bottom 0.254: v38.1,50.8 36.83,50.8 35.56,49.53 18.41,49.53 v17.14,50.8
CV10  (via drill 0.38)
  Top 0.254: U2.10 41.21,51.37 v39.37,49.53 | v31.11,50.8 R19.1 R20.2
  Bottom 0.254: v39.37,49.53 39.37,50.8 38.1,52.07 36.83,52.07 35.56,50.8 v31.11,50.8
CV11  (via drill 0.38)
  Top 0.254: R22.2 v17.14,48.26 R21.1 | U2.11 41.85,50.74 40.64,49.53 40.64,48.9 40.01,48.26 v38.1,48.26
  Bottom 0.254: v38.1,48.26 36.83,48.26 35.56,46.99 18.41,46.99 v17.14,48.26
CV12  (via drill 0.38)
  Top 0.254: U2.12 42.48,50.1 41.27,48.9 41.27,48.26 40.01,46.99 v39.37,46.99 | v31.11,48.26 R23.1 R24.2
  Bottom 0.254: v39.37,46.99 39.37,48.26 38.1,49.53 36.83,49.53 35.56,48.26 v31.11,48.26
CV13  (via drill 0.38)
  Top 0.254: R26.2 v17.14,45.72 R25.1 | U2.13 46.93,50.1 46.35,49.53 43.81,49.53 40.01,45.72 v38.1,45.72
  Bottom 0.254: v38.1,45.72 36.83,45.72 35.56,44.45 18.41,44.45 v17.14,45.72
CV14  (via drill 0.38)
  Top 0.254: R28.2 v31.11,45.72 R27.1 | U2.14 51.5,50.74 52.07,50.16 50.8,48.9 44.45,48.9 40.01,44.45 v39.37,44.45
  Bottom 0.254: v39.37,44.45 39.37,45.72 38.1,46.99 36.83,46.99 35.56,45.72 v31.11,45.72
CV15  (via drill 0.38)
  Top 0.254: R30.2 v17.14,43.18 R29.1 | U2.15 46.42,51.37 v46.35,51.44
  Bottom 0.254: v46.35,51.44 46.35,50.16 40.64,44.45 40.64,43.81 40.01,43.18 v38.1,43.18 36.83,43.18 35.56,41.91 18.41,41.91 v17.14,43.18
CV16  (via drill 0.38)
  Top 0.254: R32.2 v31.11,43.18 R31.1 | U2.16 48.32,52.01 v46.99,53.34 | v39.37,41.91 39.37,43.18 v38.1,44.45
  Bottom 0.254: v46.99,53.34 47.62,52.7 47.62,50.16 41.91,44.45 41.91,43.18 40.64,41.91 v39.37,41.91 | v38.1,44.45 36.83,44.45 35.56,43.18 v31.11,43.18
CV17  (via drill 0.38)
  Top 0.254: R34.2 v17.14,40.64 R33.1 | v38.1,40.64 41.91,40.64 43.18,39.37 43.18,36.83 44.45,35.56 44.45,34.33 U3.1
  Bottom 0.254: v17.14,40.64 18.41,39.37 35.56,39.37 36.83,40.64 v38.1,40.64
CV18  (via drill 0.38)
  Top 0.254: R36.2 v31.11,40.64 R35.1 | v39.37,39.37 41.91,36.83 41.91,34.92 43.18,33.66 44.49,33.66 U3.2
  Bottom 0.254: v31.11,40.64 35.56,40.64 36.83,41.91 38.1,41.91 39.37,40.64 v39.37,39.37
CV19  (via drill 0.38)
  Top 0.254: R38.2 v17.14,38.1 R37.1 | U3.3 42.61,32.96 41.27,34.29 41.27,36.2 39.37,38.1 v38.1,38.1
  Bottom 0.254: v17.14,38.1 18.41,36.83 35.56,36.83 36.83,38.1 v38.1,38.1
CV20  (via drill 0.38)
  Top 0.254: R40.2 v31.11,38.1 R39.1 | v39.37,36.83 40.64,35.56 40.64,33.66 41.91,32.38 44.49,32.38 U3.4
  Bottom 0.254: v31.11,38.1 35.56,38.1 36.83,39.37 38.1,39.37 39.37,38.1 v39.37,36.83
CV21  (via drill 0.38)
  Top 0.254: R42.2 v17.14,35.56 R41.1 | U3.5 45.66,31.69 v46.35,32.38
  Bottom 0.254: v46.35,32.38 45.72,33.02 39.37,33.02 38.1,34.29 18.41,34.29 v17.14,35.56
CV22  (via drill 0.38)
  Top 0.254: R44.2 v31.11,35.56 R43.1 | v39.37,34.29 39.37,33.66 41.91,31.11 44.49,31.11 U3.6
  Bottom 0.254: v31.11,35.56 35.56,35.56 36.83,36.83 38.1,36.83 39.37,35.56 v39.37,34.29
CV23  (via drill 0.38)
  Top 0.254: R46.2 v17.14,33.02 R45.1 | U3.7 46.29,30.42 v46.35,30.48
  Bottom 0.254: v17.14,33.02 18.41,31.75 38.1,31.75 39.37,30.48 v46.35,30.48
CV24  (via drill 0.38)
  Top 0.254: R48.2 v31.11,33.02 R47.1 | v39.37,31.75 40.01,31.75 41.91,29.84 44.49,29.84 U3.8
  Bottom 0.254: v31.11,33.02 38.1,33.02 v39.37,31.75
CV25  (via drill 0.38)
  Top 0.254: R50.2 v17.14,30.48 R49.1 | U3.9 41.34,29.15 40.01,30.48 38.1,30.48 37.47,29.84 v37.47,29.21
  Bottom 0.254: v17.14,30.48 18.41,29.21 v37.47,29.21
CV26  (via drill 0.38)
  Top 0.254: R52.2 v31.11,30.48 R51.1 | v39.37,29.21 40.01,28.57 44.49,28.57 U3.10
  Bottom 0.254: v31.11,30.48 38.1,30.48 v39.37,29.21
CV27  (via drill 0.38)
  Top 0.254: R54.2 v17.14,27.94 R53.1 | U3.11 39.43,27.88 38.73,28.57 38.1,28.57 37.47,27.94 v37.47,26.67
  Bottom 0.254: v17.14,27.94 18.41,26.67 v37.47,26.67
CV28  (via drill 0.38)
  Top 0.254: R56.2 v31.11,27.94 R55.1 | v39.37,26.67 40.01,27.3 44.49,27.3 U3.12
  Bottom 0.254: v31.11,27.94 38.1,27.94 v39.37,26.67
CV29  (via drill 0.38)
  Top 0.254: R58.2 v17.14,25.4 R57.1 | U3.13 49.93,25.8 v48.26,24.13
  Bottom 0.254: v17.14,25.4 18.41,24.13 v48.26,24.13
CV30  (via drill 0.38)
  Top 0.254: R60.2 v31.11,25.4 R59.1 | U3.14 48.2,27.88 47.62,27.3 v47.62,25.4
  Bottom 0.254: v47.62,25.4 v31.11,25.4
CV31  (via drill 0.38)
  Top 0.254: R62.2 v17.14,22.86 R61.1 | U3.15 47.56,28.51 46.99,27.94 46.99,26.04 42.55,21.59 v39.37,21.59
  Bottom 0.254: v17.14,22.86 18.41,21.59 v39.37,21.59
CV32  (via drill 0.38)
  Top 0.254: R64.2 v31.11,22.86 R63.1 | U3.16 46.93,29.15 46.35,28.57 46.35,26.67 42.55,22.86 v41.27,22.86
  Bottom 0.254: v31.11,22.86 v41.27,22.86
DIP1
  Top 0.254: S1.16 ARDUINO.20
DIP2
  Top 0.254: S1.15 ARDUINO.21
DIP3
  Top 0.254: S1.14 ARDUINO.22
DIP4
  Top 0.254: S1.13 ARDUINO.23
DIP5
  Top 0.254: S1.12 ARDUINO.24
DIP6
  Top 0.254: S1.11 ARDUINO.25
DIP7
  Top 0.254: S1.10 ARDUINO.26
DIP8  (via drill 0.38)
  Top 0.254: S1.9 73.66,60.96 72.39,59.69 68.58,59.69 | 68.58,59.69 v67.31,58.42 68.58,59.69 | v60.96,43.18 ARDUINO.11
  Bottom 0.254: v67.31,58.42 67.31,44.45 | 67.31,44.45 66.04,43.18 v60.96,43.18 | v67.31,58.42 67.31,44.45 | v67.31,58.42 67.31,44.45 | v67.31,58.42 67.31,44.45
EOC0  (via drill 0.38)
  Top 0.254: U2.24 50.1,57.09 v51.44,58.42
  Bottom 0.254: v51.44,58.42 53.34,58.42 ARDUINO.4
EOC1  (via drill 0.38)
  Top 0.254: v54.61,36.83 54.61,57.15 ARDUINO.5 | U3.24 50.1,34.23 v51.44,35.56
  Bottom 0.254: v51.44,35.56 52.07,36.2 53.98,36.2 v54.61,36.83
GND  (via drill 0.38)
  Top 0.254: R57.2 R61.2 | C21.2 36.83,62.23 36.2,61.59 | U3.18 52.13,30.42 v52.7,29.84 | U2.18 52.64,53.28 v53.34,53.98
  Top 1.016: R3.2 R7.2 R11.2 R15.2 R19.2 | R1.2 R5.2 R9.2 R13.2 R17.2 R21.2 R25.2 R29.2 R33.2 R37.2 R41.2 R45.2 R49.2 R53.2 R57.2 | U1.6 U1.7 U1.8 31.75,19.05 33.02,20.32 34.29,20.32 35.56,21.59 35.56,22.73 R63.2 | U1.6 U1.5 24.13,19.05 21.59,21.59 21.59,25.4 21.72,25.27 R61.2 | J1.39 J1.40 12.7,6.35 POWER.1 GND.1 | U1.6 C1.2 33.02,6.35 34.29,5.08
  Bottom 0.508: C22.2 52.7,45.72 53.98,46.99 53.98,53.34 v53.34,53.98
  other vias: 78.74,19.05 60.96,46.23 59.44,68.58 76.96,31.75 41.4,39.12
  pour Top (isolate 0.381): 8.89,0 7.62,1.27 7.62,5.08 5.08,7.62 1.27,7.62 0,8.89 0,64.77 1.27,66.04 5.08,66.04 7.62,68.58 7.62,72.39 8.89,73.66 78.74,73.66 80.01,72.39 80.01,68.58 82.55,66.04 86.36,66.04 87.63,64.77 87.63,8.89 86.36,7.62 82.55,7.62 80.01,5.08 80.01,1.27 78.74,0
  pour Bottom (isolate 0.381): 8.89,0 7.62,1.27 7.62,5.08 5.08,7.62 1.27,7.62 0,8.89 0,64.77 1.27,66.04 5.08,66.04 7.62,68.58 7.62,72.39 8.89,73.66 78.74,73.66 80.01,72.39 80.01,68.58 82.55,66.04 86.36,66.04 87.63,64.77 87.63,8.89 86.36,7.62 82.55,7.62 80.01,5.08 80.01,1.27 78.74,0
LEDCLK
  Top 0.254: J3.2 J3.1 76.2,33.02 74.93,34.29 74.93,40.64 73.66,41.91 67.31,41.91 60.96,48.26 ARDUINO.9
LEDDAT  (via drill 0.38)
  Top 0.254: J3.4 J3.3 76.2,30.48 74.3,32.38 74.3,38.1 73.03,39.37 67.31,39.37 v62.23,44.45 | v60.96,50.8 ARDUINO.8
  Bottom 0.254: v62.23,44.45 62.23,49.53 v60.96,50.8
MISO  (via drill 0.38)
  Top 0.254: ARDUINO.30 68.58,71.12 53.34,71.12 52.07,69.85 52.07,62.23 v49.53,59.69 48.26,58.42 48.26,57.15 48.96,56.45 U2.23 | v52.07,47.62 52.7,46.99 52.7,41.91 52.07,41.27 48.9,41.27 48.26,40.64 48.26,34.29 48.9,33.66 49.87,33.66 U3.23
  Bottom 0.254: v49.53,59.69 50.16,59.05 50.16,49.53 v52.07,47.62
MOSI  (via drill 0.38)
  Top 0.254: U2.22 51.37,55.82 52.7,57.15 52.7,69.22 53.34,69.85 67.31,69.85 ARDUINO.29 | U3.22 51.37,32.96 v51.44,33.02
  Bottom 0.254: v51.44,33.02 52.7,34.29 57.15,34.29 58.42,35.56 58.42,64.77 59.69,66.04 ARDUINO.29
N$2
  cutout Top (isolate 0.381): 46.35,6.99 46.35,15.88 47.62,17.14 71.75,17.14 73.03,15.88 73.03,6.99 71.75,5.71 47.62,5.71
N$3
  cutout Bottom (isolate 0.381): 46.35,15.88 47.62,17.14 71.75,17.14 73.03,15.88 73.03,6.99 71.75,5.71 47.62,5.71 46.35,6.99
N$4
  cutout Top (isolate 0.381): 17.78,20.32 19.05,21.59 19.05,62.23 17.78,63.5 3.81,63.5 2.54,62.23 2.54,21.59 3.81,20.32
N$5
  cutout Bottom (isolate 0.381): 17.78,20.32 19.05,21.59 19.05,62.23 17.78,63.5 3.81,63.5 2.54,62.23 2.54,21.59 3.81,20.32
N$11
  Top 1.016: U1.9 U1.10 | U1.10 U1.11 | J5.1 40.64,5.08 C2.1 36.81,17.76 U1.10
PHOTO  (via drill 0.38)
  Top 0.254: J2.1 J3.9 | R65.P$1 J3.9 | J3.9 J3.10 | v68.58,55.88 ARDUINO.6
  Bottom 0.254: R65.P$1 76.71,26.16 74.93,27.94 69.85,27.94 68.58,29.21 v68.58,55.88
SCLK  (via drill 0.38)
  Top 0.254: U2.21 52.01,55.18 v52.7,55.88 53.34,56.52 53.34,67.31 54.61,68.58 ARDUINO.1 | U3.21 48.96,32.32 47.62,33.66 47.62,47.62 48.26,48.26 51.44,48.26 52.7,49.53 52.7,50.8 v52.07,51.44
  Bottom 0.254: v52.07,51.44 52.07,55.24 v52.7,55.88
V5V  (via drill 0.38)
  Top 0.254: v47.62,55.88 47.62,55.24 48.9,53.98 49.87,53.98 U2.19 | U4.3 63.33,23.96 64.77,25.4 C3.1
  Top 0.381: U3.19 48.32,31.05 v48.26,31.11
  Top 0.508: J5.2 44.45,17.78 C32.1
  Top 1.016: J5.2 76.2,3.81 77.47,5.08 77.47,7.62 80.01,10.16 | 80.01,10.16 83.82,10.16 J2.2 | J3.8 J3.7 73.66,25.4 | 73.66,25.4 C3.1 66.04,38.1 63.5,40.64 ARDUINO.12 | 73.66,25.4 73.66,16.51 80.01,10.16
  Bottom 0.508: v47.62,55.88 48.9,54.61 48.9,50.16 45.72,46.99 C22.1 50.8,40.64 ARDUINO.12 | v48.26,31.11 48.26,29.21 C32.1
VCC
  Top 1.016: U1.2 U1.3 U1.4 C1.1 | 19.05,3.81 POWER.2 C1.1 | 19.05,3.81 V12.1 | 19.05,3.81 C1.1
VREF
  Top 0.254: U4.1 61.13,23.96 59.69,25.4 C4.1 | C21.1 46.35,59.05 46.35,55.24 48.9,52.7 49.87,52.7 U2.17 52.13,52.64 53.34,51.44 53.34,38.1 | C4.1 57.78,25.4 | U3.17 50,29.84 51.44,29.84 52.7,28.57 53.98,28.57 54.61,29.21 | C31.1 53.34,38.1 | 53.34,38.1 53.34,35.56 53.98,34.92 53.98,29.84 54.61,29.21 | 54.61,29.21 C4.1

### Text on the board
tPlace: OKA Battery Meter | Thought Up, Designed & / Manufactured in USA | By: / For: | Andrew Maltsev / Anatoly Maltsev | 47K | 1.5K | 47K | 1.5K | - | +
bPlace: OKA Battery Meter | Andrew Maltsev / Anatoly Maltsev | By: / For: | Thought Up, Designed & / Manufactured in USA | 8 | 7 | 6 | 5 | 4 | 3-FIL | 2-GRT | 1-DEM | BATTERIES | - | + | 7...18V